# EAGLE design pasivizator (EAGLE 7.3.0)
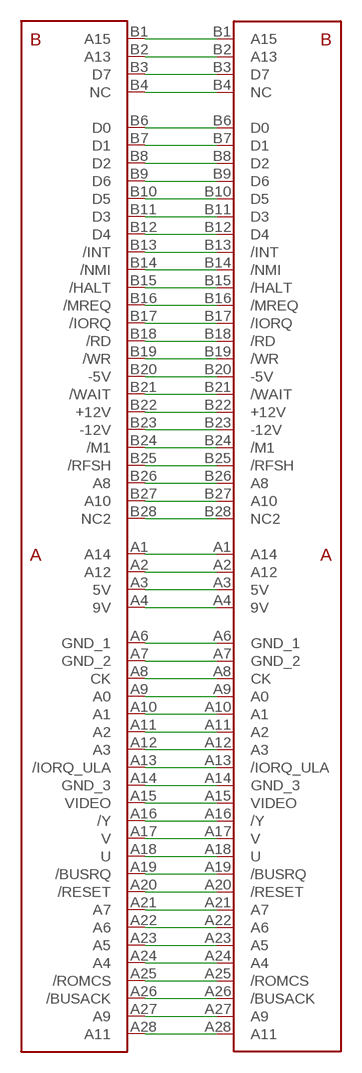
[diagram p0: schematic, sheet 1]

## Parts
U$1  ZXSP_ED2X28_SPE  [2X28_SPE]
U$3  ZXSP_ED2X28_SPE  [2X28_SPE]

## Nets
N$1: U$1.B22(+12V) U$3.B22(+12V)
N$2: U$1.B20(-5V) U$3.B20(-5V)
N$3: U$1.B23(-12V) U$3.B23(-12V)
N$4: U$1.A26(/BUSACK) U$3.A26(/BUSACK)
N$5: U$1.A19(/BUSRQ) U$3.A19(/BUSRQ)
N$6: U$1.B15(/HALT) U$3.B15(/HALT)
N$7: U$1.B13(/INT) U$3.B13(/INT)
N$8: U$1.B17(/IORQ) U$3.B17(/IORQ)
N$9: U$1.A13(/IORQ_ULA) U$3.A13(/IORQ_ULA)
N$10: U$1.B24(/M1) U$3.B24(/M1)
N$11: U$1.B16(/MREQ) U$3.B16(/MREQ)
N$12: U$1.B14(/NMI) U$3.B14(/NMI)
N$13: U$1.B18(/RD) U$3.B18(/RD)
N$14: U$1.A20(/RESET) U$3.A20(/RESET)
N$15: U$1.B25(/RFSH) U$3.B25(/RFSH)
N$16: U$1.A25(/ROMCS) U$3.A25(/ROMCS)
N$17: U$1.B21(/WAIT) U$3.B21(/WAIT)
N$18: U$1.B19(/WR) U$3.B19(/WR)
N$19: U$1.A16(/Y) U$3.A16(/Y)
N$20: U$1.A3(5V) U$3.A3(5V)
N$21: U$1.A4(9V) U$3.A4(9V)
N$22: U$1.A9(A0) U$3.A9(A0)
N$23: U$1.A10(A1) U$3.A10(A1)
N$24: U$1.A11(A2) U$3.A11(A2)
N$25: U$1.A12(A3) U$3.A12(A3)
N$26: U$1.A24(A4) U$3.A24(A4)
N$27: U$1.A23(A5) U$3.A23(A5)
N$28: U$1.A22(A6) U$3.A22(A6)
N$29: U$1.A21(A7) U$3.A21(A7)
N$30: U$1.B26(A8) U$3.B26(A8)
N$31: U$1.A27(A9) U$3.A27(A9)
N$32: U$1.B27(A10) U$3.B27(A10)
N$33: U$1.A28(A11) U$3.A28(A11)
N$34: U$1.A2(A12) U$3.A2(A12)
N$35: U$1.B2(A13) U$3.B2(A13)
N$36: U$1.A1(A14) U$3.A1(A14)
N$37: U$1.B1(A15) U$3.B1(A15)
N$38: U$1.A8(CK) U$3.A8(CK)
N$39: U$1.B6(D0) U$3.B6(D0)
N$40: U$1.B7(D1) U$3.B7(D1)
N$41: U$1.B8(D2) U$3.B8(D2)
N$42: U$1.B11(D3) U$3.B11(D3)
N$43: U$1.B12(D4) U$3.B12(D4)
N$44: U$1.B10(D5) U$3.B10(D5)
N$45: U$1.B9(D6) U$3.B9(D6)
N$46: U$1.B3(D7) U$3.B3(D7)
N$47: U$1.A6(GND_1) U$3.A6(GND_1)
N$48: U$1.A7(GND_2) U$3.A7(GND_2)
N$49: U$1.A14(GND_3) U$3.A14(GND_3)
N$50: U$1.B4(NC) U$3.B4(NC)
N$51: U$1.B28(NC2) U$3.B28(NC2)
N$52: U$1.A18(U) U$3.A18(U)
N$53: U$1.A17(V) U$3.A17(V)
N$54: U$1.A15(VIDEO) U$3.A15(VIDEO)

## Library data of the parts
U$1 U$3 = zx_edge:ZXSP_ED

## Board
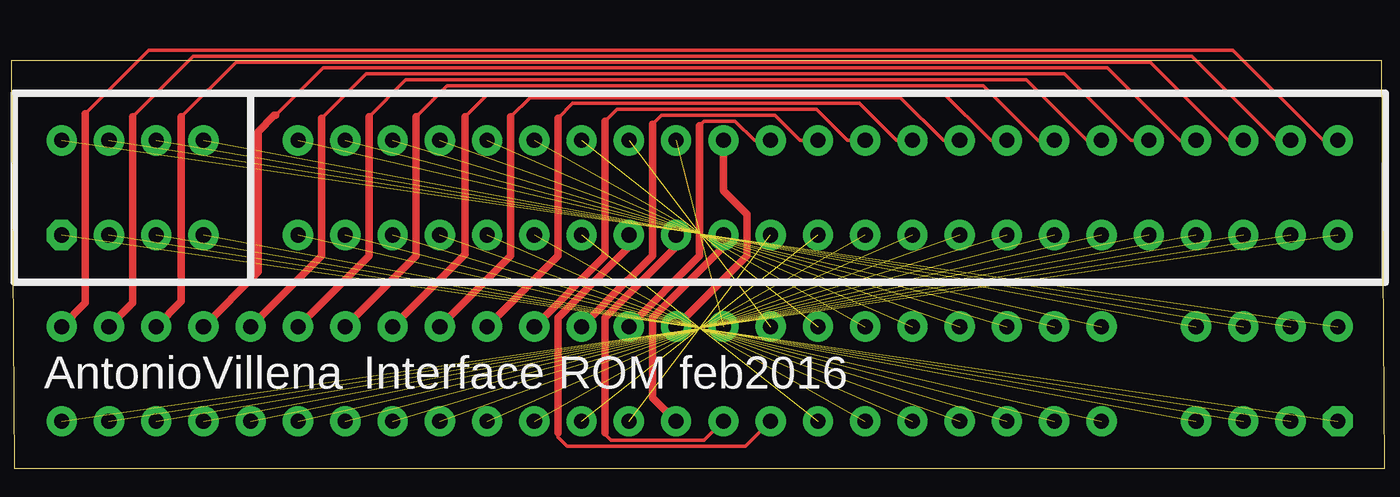
[diagram p1: board, top side]
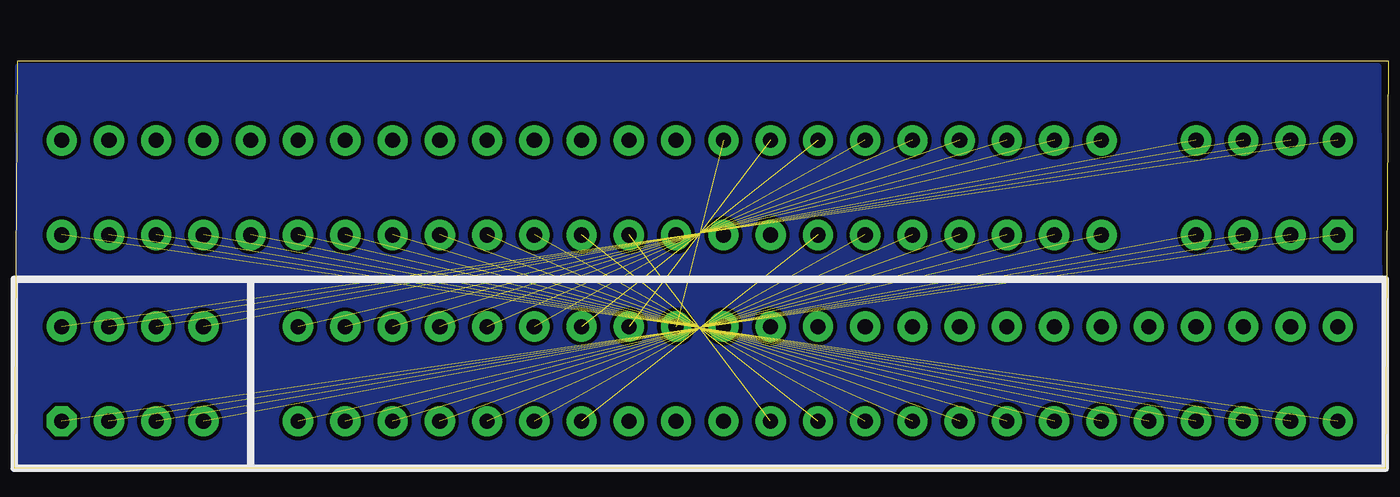
[diagram p2: board, bottom side, seen from below]

No outline drawn. Coordinates in mm, seen from the top.
Copper layers (1*16): Top 0.035mm / dielectric 1.5mm / Bottom 0.035mm
Design rules "default": minimum track width 10mil, minimum drill 24mil, track to track 8mil, track to pad 8mil, pad to pad 8mil, via to via 8mil, smd to smd 8mil, copper to edge 40mil, drill to drill 8mil, minimum pad ring 10mil, minimum via ring 8mil, stop-mask expansion 4mil, vias tented up to drill 0mil, thermal gap 10mil
Milling: 4 lines

### Footprints (pad centres in the part's own frame; a part is rotated, then mirrored left to right if it is on the bottom)
2X28_SPE = drill 0.813 pad 1.626 octagon: A1 0,-5.08 | drill 0.813 pad 1.626: A2 2.54,-5.08; A3 5.08,-5.08; A4 7.62,-5.08; A6 12.7,-5.08; A7 15.24,-5.08; A8 17.78,-5.08; A9 20.32,-5.08; A10 22.86,-5.08; A11 25.4,-5.08; A12 27.94,-5.08; A13 30.48,-5.08; A14 33.02,-5.08; A15 35.56,-5.08; A16 38.1,-5.08; A17 40.64,-5.08; A18 43.18,-5.08; A19 45.72,-5.08; A20 48.26,-5.08; A21 50.8,-5.08; A22 53.34,-5.08; A23 55.88,-5.08; A24 58.42,-5.08; A25 60.96,-5.08; A26 63.5,-5.08; A27 66.04,-5.08; A28 68.58,-5.08; B1 0,0; B2 2.54,0; B3 5.08,0; B4 7.62,0; B6 12.7,0; B7 15.24,0; B8 17.78,0; B9 20.32,0; B10 22.86,0; B11 25.4,0; B12 27.94,0; B13 30.48,0; B14 33.02,0; B15 35.56,0; B16 38.1,0; B17 40.64,0; B18 43.18,0; B19 45.72,0; B20 48.26,0; B21 50.8,0; B22 53.34,0; B23 55.88,0; B24 58.42,0; B25 60.96,0; B26 63.5,0; B27 66.04,0; B28 68.58,0

### Placement (x,y rotation side)
U$1  2.54,17.62 0 top
U$3  71.12,7.62 0 bottom

### Tracks (layer width: path | path; a pad name or v marks a point on that pad's centre or on a via)
GND
  pour Bottom: 0.4,21.59 73.42,21.59 73.34,0.32 0.32,0.32
N$1
  Top 0.2: U$1.B22 55.01,17.62 52.07,20.56 23.26,20.56 21.59,18.89
  Top 0.406: U$3.B22 18.93,8.77 19.05,8.89 21.59,11.43 21.59,18.89
N$2
  Top 0.2: U$1.B20 49.93,17.62 47.62,19.92 27.7,19.92 26.67,18.89
  Top 0.406: U$3.B20 23.85,8.61 24.13,8.89 26.67,11.43 26.67,18.89
N$3
  Top 0.2: U$1.B23 57.63,17.62 54.37,20.88 21.03,20.88 19.05,18.89
  Top 0.406: 19.05,18.89 19.05,11.43 U$3.B23
N$4  (1 unrouted)
N$5  (1 unrouted)
N$6
  Top 0.406: U$1.B15 38.1,14.92 39.37,13.65 39.37,11.43 U$3.B15
N$7  (1 unrouted)
N$8
  Top 0.2: U$1.B17 42.23,17.62 40.88,18.97 34.77,18.97 34.29,18.49
  Top 0.406: U$3.B17 31.71,8.85 31.75,8.89 34.29,11.43 34.29,18.49
N$9
  Top 0.2: 29.21,1.91 29.21,1.67 29.69,1.19 39.29,1.19 U$3.A13
  Top 0.406: U$1.A13 33.02,11.91 29.21,8.1 29.21,1.91
N$10
  Top 0.2: U$1.B24 60.01,17.62 56.44,21.19 18.89,21.19 16.51,18.81
  Top 0.406: 16.51,18.81 16.51,11.43 U$3.B24
N$11
  Top 0.2: U$1.B16 39.77,17.62 38.73,18.65 37.07,18.65 36.83,18.41
  Top 0.406: 36.83,18.41 36.83,11.43 U$3.B16
N$12  (1 unrouted)
N$13
  Top 0.2: U$1.B18 44.77,17.62 43.1,19.29 32.38,19.29 31.75,18.65
  Top 0.406: 31.75,18.65 31.75,11.43 U$3.B18
N$14  (1 unrouted)
N$15
  Top 0.2: U$1.B25 62.63,17.62 58.74,21.51 16.59,21.51 14.05,18.97
  Top 0.406: 14.05,18.97 13.97,18.97 13.1,18.1 13.1,10.56 U$3.B25
N$16  (1 unrouted)
N$17
  Top 0.2: U$1.B21 52.47,17.62 49.85,20.24 25.56,20.24 24.21,18.89
  Top 0.406: 24.21,18.89 24.21,11.51 U$3.B21
N$18
  Top 0.2: U$1.B19 47.39,17.62 45.4,19.61 30,19.61 29.21,18.81
  Top 0.406: 29.21,18.81 29.21,11.43 U$3.B19
N$19  (1 unrouted)
N$20  (1 unrouted)
N$21  (1 unrouted)
N$22  (1 unrouted)
N$23  (1 unrouted)
N$24  (1 unrouted)
N$25  (1 unrouted)
N$26  (1 unrouted)
N$27  (1 unrouted)
N$28  (1 unrouted)
N$29  (1 unrouted)
N$30
  Top 0.2: U$1.B26 65.25,17.62 61.04,21.83 11.91,21.83 8.97,18.89
  Top 0.406: 8.97,18.89 8.97,8.97 U$3.B26
N$31  (1 unrouted)
N$32
  Top 0.2: U$1.B27 67.79,17.62 63.26,22.15 9.6,22.15 6.35,18.89
  Top 0.406: 6.35,18.89 6.35,8.89 U$3.B27
N$33  (1 unrouted)
N$34  (1 unrouted)
N$35  (1 unrouted)
N$36  (1 unrouted)
N$37  (1 unrouted)
N$38  (1 unrouted)
N$39  (1 unrouted)
N$40  (1 unrouted)
N$41  (1 unrouted)
N$42  (1 unrouted)
N$43  (1 unrouted)
N$44  (1 unrouted)
N$45  (1 unrouted)
N$46  (1 unrouted)
N$47  (1 unrouted)
N$48  (1 unrouted)
N$49
  Top 0.2: 31.75,1.91 31.75,1.83 32.07,1.51 37.07,1.51 U$3.A14
  Top 0.406: U$1.A14 35.56,11.91 31.75,8.1 31.75,1.91
N$50  (1 unrouted)
N$51
  Top 0.2: U$1.B28 70.33,17.62 65.48,22.46 7.22,22.46 3.81,19.05
  Top 0.406: 3.81,19.05 3.81,8.89 U$3.B28
N$52  (1 unrouted)
N$53  (1 unrouted)
N$54
  Top 0.406: U$1.A15 38.1,11.91 34.29,8.1 34.29,3.81 U$3.A15

### Text on the board
tPlace: AntonioVillena | Interface ROM feb2016